# Altium project HW-128 HC Boost Converter.PrjPcb
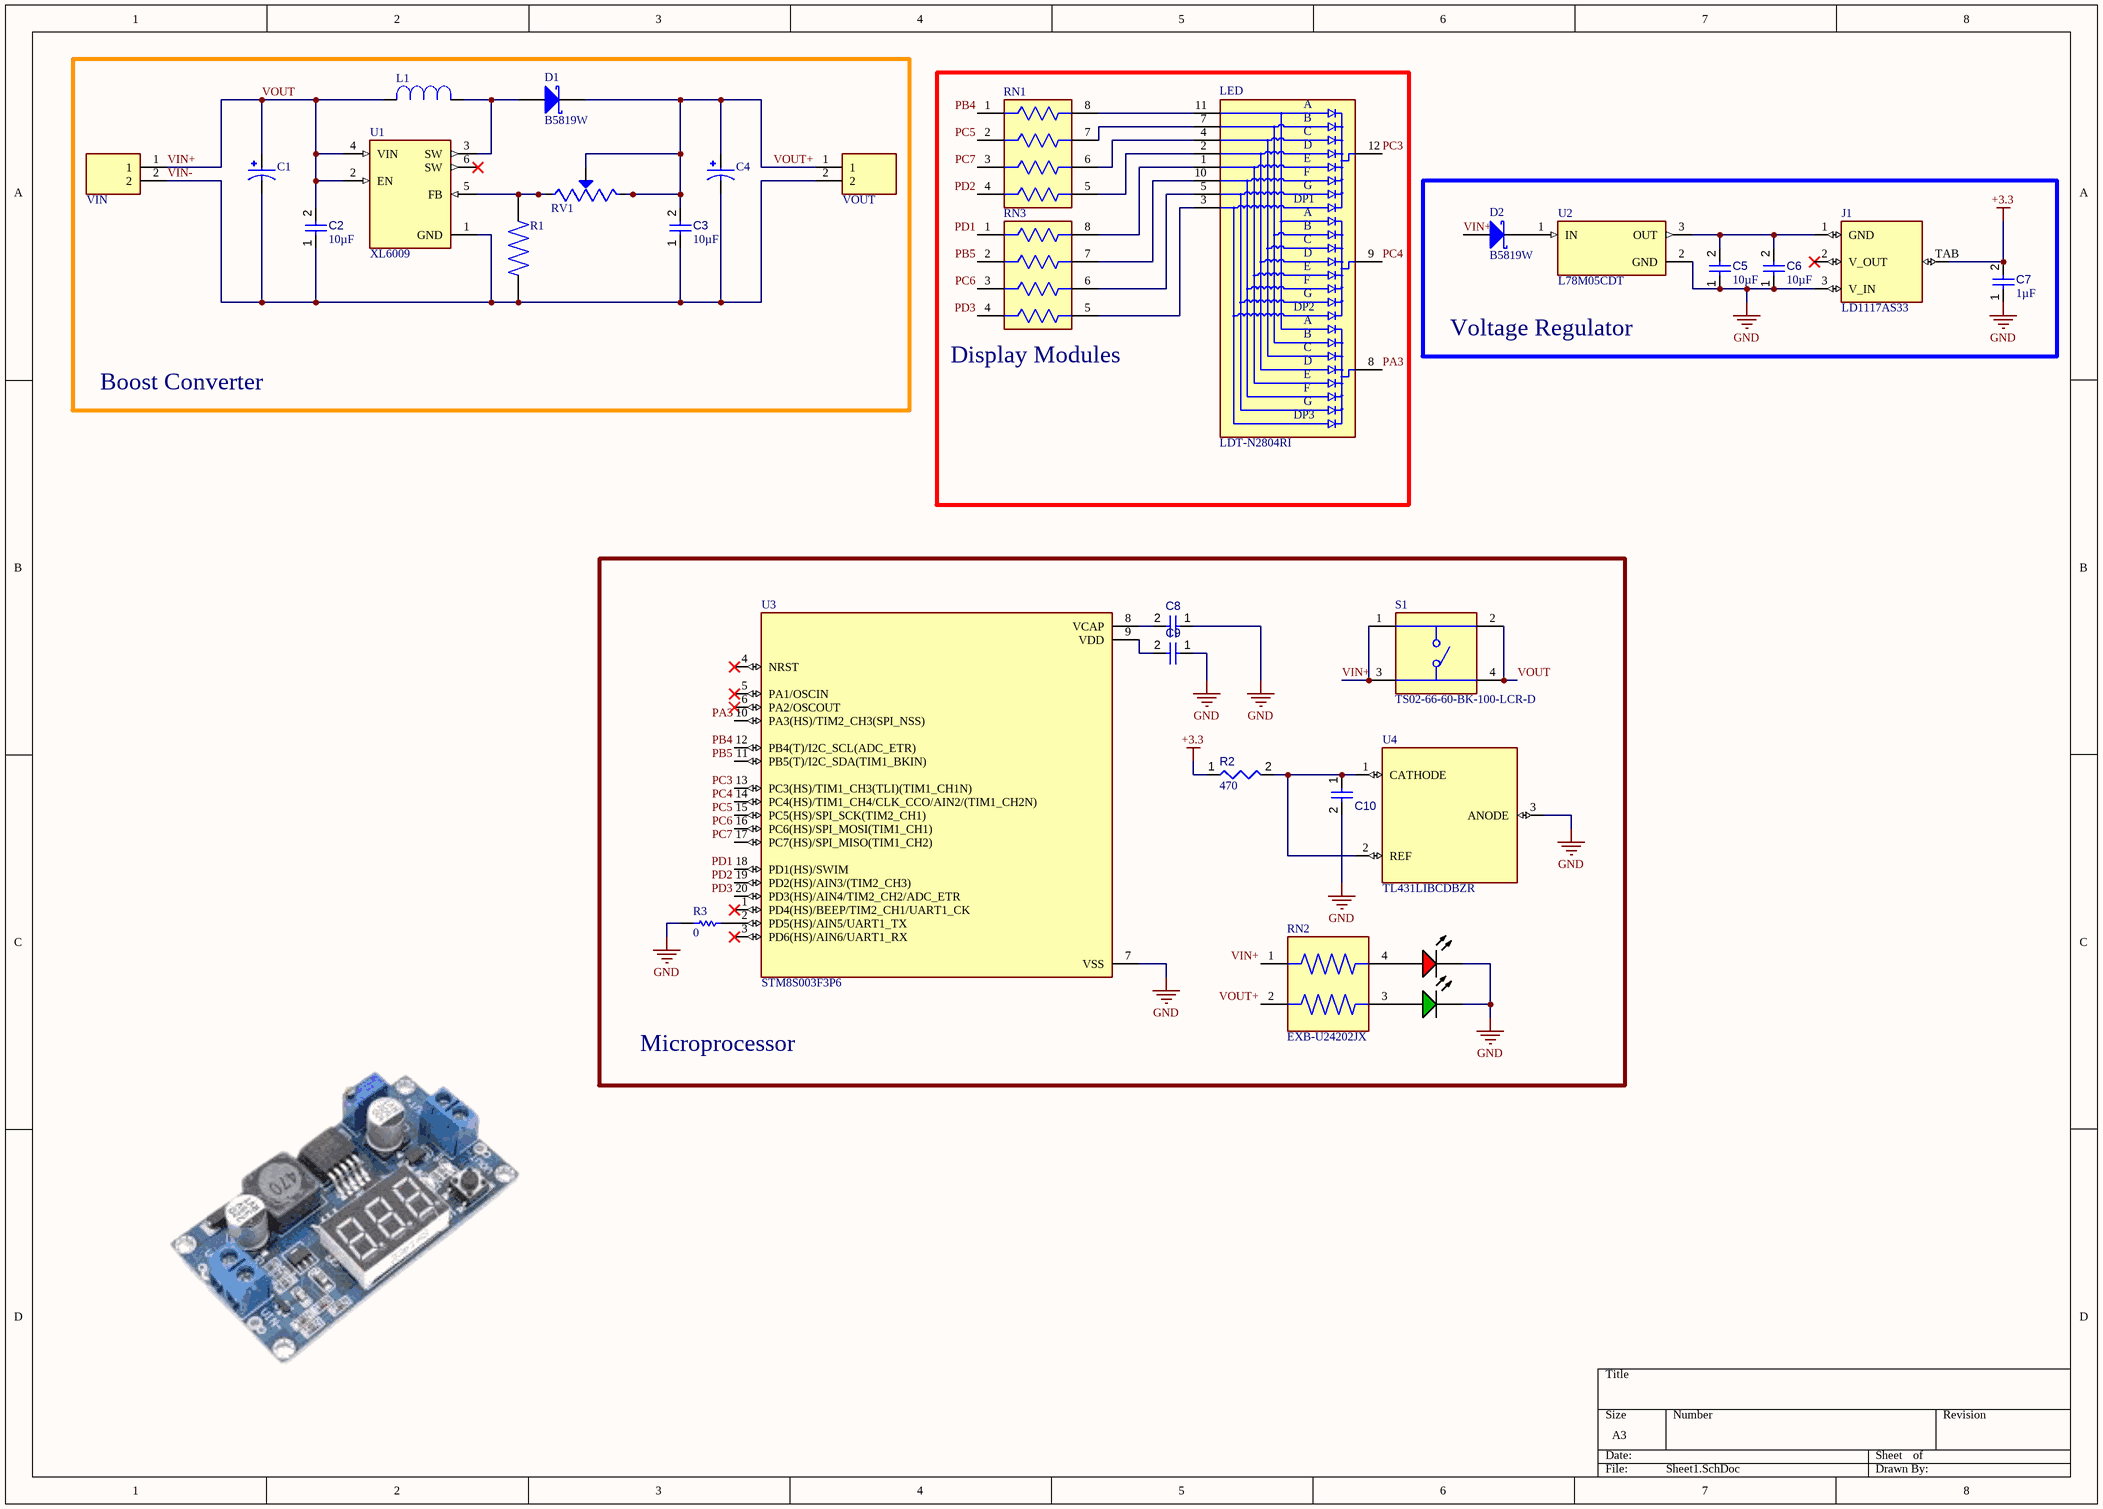
[diagram p0: Sheet1.SchDoc]
1 sheet, 31 parts. Net scope: global (net labels, ports and power ports of the same name join across sheets).
Board file: PCB1.PcbDoc

## Sheet Sheet1.SchDoc
size A3; SheetNumber: 1; SheetTotal: 1

### Parts
C1  EEEFK1V221P  [CAP_EEEFK1V221P]  (value not drawn)
C2  value 10µF  [CAPC0603(1608)100_L]  (hidden comment: Capacitor 10µF +/-20% 10V 0603)
C3  value 10µF  [CAPC0603(1608)100_L]  (hidden comment: Capacitor 10µF +/-20% 10V 0603)
C4  EEEFK1V221P  [CAP_EEEFK1V221P]  (value not drawn)
C5  value 10µF  [CAPC0603(1608)100_L]  (hidden comment: Capacitor 10µF +/-20% 10V 0603)
C6  value 10µF  [CAPC0603(1608)100_L]  (hidden comment: Capacitor 10µF +/-20% 10V 0603)
C7  value 1µF  [CAPC2013X145X50ML20T25]  (hidden comment: Capacitor 1 uF +/- 10% 25 V 0805)
C8  Capacitor 10µF +/-20% 10V 0603  [CAPC0603(1608)100_L]  (value not drawn)
C9  Capacitor 10µF +/-20% 10V 0603  [CAPC0603(1608)100_L]  (value not drawn)
C10  Capacitor 10µF +/-20% 10V 0603  [CAPC0603(1608)100_L]  (value not drawn)
D1  B5819W  [MCC-SOD123_V]
D2  B5819W  [MCC-SOD123_V]
DS2  HSMH-C190  [AVAG-HSMX-C190_V]  (value not drawn)
DS3  LTST-C190GKT  [LTST-C190GKT_V]  (value not drawn)
J1  LD1117AS33  [SOT223]
L1  DR125-470-R  [INDM125125X600N]  (value not drawn)
LED  LDT-N2804RI  [LDT-N2804RI_LUM]
R1  CR0805-FX-3300ELF  [RESC2012X60N]  (value not drawn)
R2  value 470  [RESC0805(2012)_L]  (hidden comment: Resistor 470R +/-5% 0805 125 mW)
R3  value 0  [RESC1608X55X25ML10T15]  (hidden comment: Resistor 0R +/- 5% 0603 100 mW)
RN1  CAY16-101J4LF  [FP-CAY16-J4-MFG]  (value not drawn)
RN2  EXB-U24202JX  [RESCAXE_EXB-U24202JX]
RN3  CAY16-101J4LF  [FP-CAY16-J4-MFG]  (value not drawn)
RV1  3296W1103LF  [TRIM_3296W1103LF]  (value not drawn)
S1  TS02-66-60-BK-100-LCR-D  [SW_TS02-66-60-BK-100-LCR-D]
U1  XL6009  [DPAK170P1435X465-6N]
U2  L78M05CDT  [VREG_L78M05CDT]
U3  STM8S003F3P6  [SOP65P640X120-20N]
U4  TL431LIBCDBZR  [SOT23]
VIN  TB006-508-02BE  [CUI_TB006-508-02BE]  (value not drawn)
VOUT  TB006-508-02BE  [CUI_TB006-508-02BE]  (value not drawn)

### Blocks framed on the sheet
Boost Converter: C1-C4 D1 L1 R1 RV1 U1 VIN VOUT
Display Modules: LED RN1 RN3
Voltage Regulator: C5-C7 D2 J1 U2
Microprocessor: C8-C10 DS2 DS3 R2 R3 RN2 S1 U3 U4

### Nets
+3.3: C7.2 J1.TAB(V_OUT2) R2.1
GND: C5.1 C6.1 C7.1 C8.1 C9.1 C10.2 DS2.2(K) DS3.2(K) J1.3(V_IN) R3.1 U2.2(GND) U3.7(VSS) U4.3(ANODE)
PA3: LED.8 U3.10(PA3(HS)/TIM2_CH3(SPI_NSS))
PB4: RN1.1 U3.12(PB4(T)/I2C_SCL(ADC_ETR))
PB5: RN3.2 U3.11(PB5(T)/I2C_SDA(TIM1_BKIN))
PC3: LED.12 U3.13(PC3(HS)/TIM1_CH3(TLI)(TIM1_CH1N))
PC4: LED.9 U3.14(PC4(HS)/TIM1_CH4/CLK_CCO/AIN2/(TIM1_CH2N))
PC5: RN1.2 U3.15(PC5(HS)/SPI_SCK(TIM2_CH1))
PC6: RN3.3 U3.16(PC6(HS)/SPI_MOSI(TIM1_CH1))
PC7: RN1.3 U3.17(PC7(HS)/SPI_MISO(TIM1_CH2))
PD1: RN3.1 U3.18(PD1(HS)/SWIM)
PD2: RN1.4 U3.19(PD2(HS)/AIN3/(TIM2_CH3))
PD3: RN3.4 U3.20(PD3(HS)/AIN4/TIM2_CH2/ADC_ETR)
VIN+: C1.1 C2.2 D2.1(A) L1.2 RN2.1 S1.1 S1.2 S1.3 S1.4 U1.2(EN) U1.4(VIN) VIN.1  [also labelled VOUT]
VIN-: C1.2 C2.1 C3.1 C4.2 R1.1 U1.1(GND) VIN.2 VOUT.2
VOUT+: C3.2 C4.1 D1.2(K) RN2.2 RV1.2(WIPER) RV1.3(CW) VOUT.1
NetC5_2: C5.2 C6.2 J1.1(GND) U2.3(OUT)
NetC8_2: C8.2 U3.8(VCAP)
NetC9_2: C9.2 U3.9(VDD)
NetC10_1: C10.1 R2.2 U4.1(CATHODE) U4.2(REF)
NetD1_1: D1.1(A) L1.1 U1.3(SW)
NetD2_2: D2.2(K) U2.1(IN)
NetDS2_1: DS2.1(A) RN2.4
NetDS3_1: DS3.1(A) RN2.3
NetLED_1: LED.1 RN3.8
NetLED_2: LED.2 RN1.5
NetLED_3: LED.3 RN3.5
NetLED_4: LED.4 RN1.6
NetLED_5: LED.5 RN3.6
NetLED_7: LED.7 RN1.7
NetLED_10: LED.10 RN3.7
NetLED_11: LED.11 RN1.8
NetR1_2: R1.2 RV1.1(CCW) U1.5(FB)
NetR3_2: R3.2 U3.2(PD5(HS)/AIN5/UART1_TX)

Not connected (* = marked no-connect by the designer): J1 2(V_OUT)*; U1 6(SW)*; U3 1(PD4(HS)/BEEP/TIM2_CH1/UART1_CK)* 3(PD6(HS)/AIN6/UART1_RX)* 4(NRST)* 5(PA1/OSCIN)* 6(PA2/OSCOUT)*

### Notes on the sheet
- (in symbol LDT-N2804RI) A; B; C; D; E; F; G; DP1; DP2; DP3

### Library data of the parts
C1 C4 = EEEFK1V221P: 220ÂµF 35V Aluminum Electrolytic Capacitors Radial, Can - SMD 2000 Hrs @ 105Â°C; MF: Panasonic; SnapEDA_Link: https://www.snapeda.com/parts/EEEFK1V221P/Panasonic/view-part/?ref=snap; Package: RADIAL-2 Panasonic; Value: *; MP: EEEFK1V221P; Check_prices: https://www.snapeda.com/parts/EEEFK1V221P/Panasonic/view-part/?ref=eda
C2 C3 C5 C6 C8-C10 = CMP-001-00075-4: Chip Capacitor, 10µF +/-20%, 10V, 0603, Thickness 1 mm; Tolerance: 10%; Voltage Rating: 10V; Max Operating Temperature: 85°C; Pins: 2; Case/Package: 0603; Mounting Technology: SMT; Min Operating Temperature: -55°C
  C8-C10: Value: 10µF
C7 = CMP-001-00010-6: Chip Capacitor, 1 uF, +/-10%, 25 V, 0805 (2012 Metric); Capacitor Type: Ceramic; Voltage Rating: 25V; RoHS Compliant: True; Pins: 2; Mounting Technology: SM; Max Operating Temperature: 125°C; Min Operating Temperature: -55°C; Tolerance: 10%; Case/Package: 0805
D1 D2 = CMP-004-00005-2: Schottky Barrier Rectifier, 40 V, 1 A, -65 to 125 degC, 2-Pin SOD123, RoHS, Tape and Reel; Manufacturer: Micro Commercial Components; Datasheet Version: Rev. B, 01/2013; RoHS Compliant: Unknown; Manufacturer URL: http://www.mccsemi.com/; Package URL: http://www.mccsemi.com/up_pdf/1N4448W(SOD-123).pdf; Case/Package: SOD123; Mounting Technology: SM; Datasheet URL: http://www.mccsemi.com/up_pdf/B5817W-B5819W(SOD-123).pdf; Package Description: 2-Pin Small Outline Diode, Body 2.7 x 1.6 mm, Height 1.35 mm; Package Reference: SOD123
DS2 = CMP-007-00014-2: LED Uni-Color Red, 65 mW, 20 mA, -40 to 85 degC, 2-Pin SMD, RoHS, Tape and Reel; Manufacturer: Avago; Nominal Vf: 1.8V; Luminous Intensity: 17mcd; Power: 78mW; Forward Current: 20mA; Lens Style: Diffused; Viewing Angle: 170degrees; Package Quantity: 4000; Colour: Red; Manufacturer URL: http://www.avagotech.com/; Min Operating Temperature: -40°C; Datasheet URL: http://docs.avagotech.com/docs/AV02-0551EN; RoHS Compliant: True; Forward Voltage: 1.8V; Pins: 2; Max Operating Temperature: 85°C; Packaging: TapeandReel; Package Reference: HSMX-C190; Datasheet Version: Mar-12; Package Description: 2-Pin Surface Mount Device, Body 1.6 x 0.8 mm, Height 0.9 mm; Case/Package: 0603; Mounting Technology: SM; Illumination Colour: Red
DS3 = CMP-007-00022-2: LED Uni-Color Green, 100 mW, 30 mA, -55 to 85 degC, 2-Pin SMD, RoHS, Tape and Reel; Manufacturer: Lite-On; Power: 100mW; Forward Voltage: 2.1V; Viewing Angle: 130degrees; Forward Current: 20mA; Luminous Intensity: 6mcd; Lens Style: Clear; Manufacturer URL: http://www.us.liteon.com/; RoHS Compliant: True; Colour: Green; Package Description: 2-Pin Surface Mount Device, Body 1.6 x 0.8 mm; Datasheet URL: http://datasheet.octopart.com/LTST-C190GKT-Lite-On-datasheet-158530.pdf; Datasheet Version: Dec-06; Mounting Technology: SM; Case/Package: 0603; Package Reference: C190GKT; Packaging: TapeandReel; Min Operating Temperature: -55°C; Nominal Vf: 2.1V; Package Quantity: 3000; Illumination Colour: Green; Max Operating Temperature: 85°C; Pins: 2
J1 = LD1117AS33: Linear Voltage Regulator IC Positive Fixed 1 Output 1A SOT-223; MF: STMicroelectronics; SnapEDA_Link: https://www.snapeda.com/parts/LD1117AS33/STMicroelectronics/view-part/?ref=snap; Package: SOT-223 STMicroelectronics; Value: *; MP: LD1117AS33; Check_prices: https://www.snapeda.com/parts/LD1117AS33/STMicroelectronics/view-part/?ref=eda
L1 = DR125-470-R: 47ÂµH Shielded Wirewound Inductor 2.71A 74mOhm Nonstandard; MF: Eaton; Digi-Key_Part_Number: 513-1128-1-ND; SnapEDA_Link: https://www.snapeda.com/parts/DR125-470-R/Eaton/view-part/2729976/?ref=snap; Check_prices: https://www.snapeda.com/parts/DR125-470-R/Eaton/view-part/2729976/?ref=eda; Package: Nonstandard Eaton; Purchase-URL: https://pricing.snapeda.com/search/part/DR125-470-R/?ref=eda; MP: DR125-470-R; Value: *
LED = LDT-N2804RI: Display Modules - LED Character and Numeric Red 7-Segment 3 Character Common Cathode 2V 10mA 0.394 H x 0.887 W x 0.240 D (10.00mm x 22.53mm x 6.10mm) 12-DIP (0.300, 7.62mm), 11 Leads; MF: Lumex Opto/Components; SnapEDA_Link: https://www.snapeda.com/parts/LDT-N2804RI/Lumex/view-part/?ref=snap; Package: None; Value: *; MP: LDT-N2804RI; Check_prices: https://www.snapeda.com/parts/LDT-N2804RI/Lumex/view-part/?ref=eda
R1 = CR0805-FX-3300ELF: 330 Ohms Â±1% 0.125W, 1/8W Chip Resistor 0805 _2012 Metric_ Moisture Resistant Thick Film; MF: Bourns; Price: None; Package: 2012 Bourns; Availability: Unavailable; MP: CR0805-FX-3300ELF; Value: *; SnapEDA_Link: https://www.snapeda.com/parts/CR0805-FX-3300ELF/Bourns/view-part/942422/?ref=snap
R2 = CMP-009-00122-3: Chip Resistor, 470 Ohms, +/-5%, 125 mW, -55 to 155 degC, 0805; Tolerance: 5%; Power: 125mW; Max Operating Temperature: 155°C; Case/Package: 0805; Pins: 2; Min Operating Temperature: -55°C
R3 = CMP-009-00006-5: Chip Resistor, 0 Ohm, 0.1 W, -55 to 155 degC, 0603 (1608 Metric); Power: 100mW; Voltage Rating: 50V; Max Operating Temperature: 155°C; RoHS Compliant: True; Mounting Technology: SM; Case/Package: 0603; Min Operating Temperature: -55°C; Tolerance: 5%; Pins: 2
RN1 RN3 = CMP-07230-000011-1: RES ARRAY 4 RES 100 OHM 1206; Number of Terminals/Pins: 8; Number of Circuits: 4; Tolerance: 5%; Temperature Coefficient: 200ppm/°C; Power Rating: 248mW; Resistance: 100R; Power Per Element: 62.5mW; Circuit Type: Isolated; Voltage Rating (DC): 50V; Termination: Convex; REACH SVHC: No SVHC; Military Standard: Not; Series: CAY16; Length: 3.2mm; Height: 0.024inch; Mount: Surface Mount; Technology: THICK FILM; Max Operating Temperature: 125°C; Number of Pins: 8; Packaging: Tape and Reel; Min Operating Temperature: -55°C; Terminal Pitch: 0.8mm; Resistance Tolerance: 5%; Number of Elements: 4; Depth: 1.6mm; Case Code (Metric): 3216; Package Quantity: 5000; Case Code (Imperial): 1206; Width: 0.063inch; Case/Package: 1206; Contact Plating: Tin; Voltage Rating: 50V; Radiation Hardening: No; Number of Resistors: 4
RN2 = EXB-U24202JX: Series/Type: Anti-Sulfurated Chip Resistor Array, Power Rating (W): 0.063, Chip Size (LxW) (mm): 1.0 X 1.0, Resistance Values (â„¦): 2000, Resistance Tolerance (%): 5, Terminal Pitch (mm): 0.65, Type of Circuit: Isolated Circuit, Number of Elements (piece; MF: Panasonic; SnapEDA_Link: https://www.snapeda.com/parts/EXB-U24202JX/Panasonic/view-part/?ref=snap; Package: NON STANDARD-4 Panasonic; Value: *; MP: EXB-U24202JX; Check_prices: https://www.snapeda.com/parts/EXB-U24202JX/Panasonic/view-part/?ref=eda
RV1 = 3296W1103LF: Trimmer, Potentiometer 10kohm 25turn Thd; MF: Bourns; Package: None; MP: 3296W1103LF; Check_prices: https://www.snapeda.com/parts/3296W1103LF/Bourns/view-part/2487625/?ref=eda; Availability: Unavailable; Price: None; Value: *; SnapEDA_Link: https://www.snapeda.com/parts/3296W1103LF/Bourns/view-part/2487625/?ref=snap
S1 = TS02-66-60-BK-100-LCR-D: 6 x 6 mm, 6 mm Actuator Height, 100 gf, Black, Long Crimped, Through Hole, SPST, Tactile Switch; MF: Same Sky; SnapEDA_Link: https://www.snapeda.com/parts/TS02-66-60-BK-100-LCR-D/Same+Sky/view-part/?ref=snap; Package: None; Value: *; MP: TS02-66-60-BK-100-LCR-D; Check_prices: https://www.snapeda.com/parts/TS02-66-60-BK-100-LCR-D/Same+Sky/view-part/?ref=eda
U1 = XL6009: The XL6009 regulator is a wide input range, current mode, DC/DC converter which is capable of generating either positive or negative output voltages.; MF: XLSEMI; Package: TO-263-5L XLSEMI; Price: None; Value: *; SnapEDA_Link: https://www.snapeda.com/parts/XL6009/XLSEMI/view-part/?ref=snap; MP: XL6009; Availability: Not in stock; Check_prices: https://www.snapeda.com/parts/XL6009/XLSEMI/view-part/?ref=eda
U2 = L78M05CDT: 7805 based precision 5V fixed regulator with output current of up to 500mA and wide temperature operating range of 0Â°C to 150Â°C.; MF: STMicroelectronics; SnapEDA_Link: https://www.snapeda.com/parts/L78M05CDT/STMicroelectronics/view-part/?ref=snap; Package: TO-252-3 STMicroelectronics; Value: *; MP: L78M05CDT; Check_prices: https://www.snapeda.com/parts/L78M05CDT/STMicroelectronics/view-part/?ref=eda
U3 = STM8S003F3P6: STM8 series Microcontroller IC 8-Bit 16MHz 8KB (8K x 8) FLASH 20-TSSOP; MF: STMicroelectronics; SnapEDA_Link: https://www.snapeda.com/parts/STM8S003F3P6/STMicroelectronics/view-part/?ref=snap; Package: TSSOP-20 STMicroelectronics; Value: *; MP: STM8S003F3P6; Check_prices: https://www.snapeda.com/parts/STM8S003F3P6/STMicroelectronics/view-part/?ref=eda
U4 = TL431LIBCDBZR: Adjustable precision shunt regulator with optimized reference current (pin layout: KRA); MF: Texas Instruments; SnapEDA_Link: https://www.snapeda.com/parts/TL431LIBCDBZR/Texas+Instruments/view-part/?ref=snap; Package: SOT-23-3 Texas Instruments; Value: *; MP: TL431LIBCDBZR; Check_prices: https://www.snapeda.com/parts/TL431LIBCDBZR/Texas+Instruments/view-part/?ref=eda
VIN VOUT = TB006-508-02BE: 2~24 Poles, Screw Type, Horizontal, 5.08 Pitch, 26~14 (AWG), Terminal Block Connector; MF: Same Sky; SnapEDA_Link: https://www.snapeda.com/parts/TB006-508-02BE/Same+Sky/view-part/?ref=snap; Package: None; Value: *; MP: TB006-508-02BE; Check_prices: https://www.snapeda.com/parts/TB006-508-02BE/Same+Sky/view-part/?ref=eda